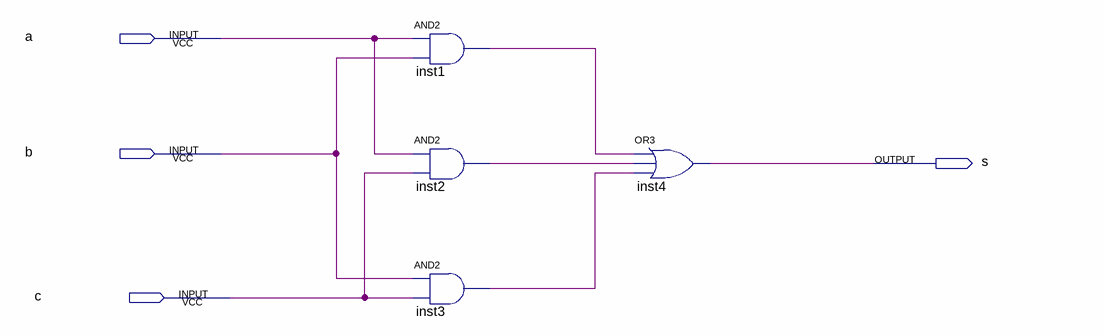
[diagram p0: schematic sheet]
// Quartus schematic bfs_maj3.bdf as structural Verilog: 4 symbols, 4 pins
module bfs_maj3 (
  input  a,
  input  b,
  input  c,
  output s
);

  wire inst1_out, inst2_out, inst3_out;

  and inst1 (inst1_out, a, b);
  and inst2 (inst2_out, a, c);
  and inst3 (inst3_out, b, c);
  or inst4 (s, inst1_out, inst2_out, inst3_out);
endmodule
